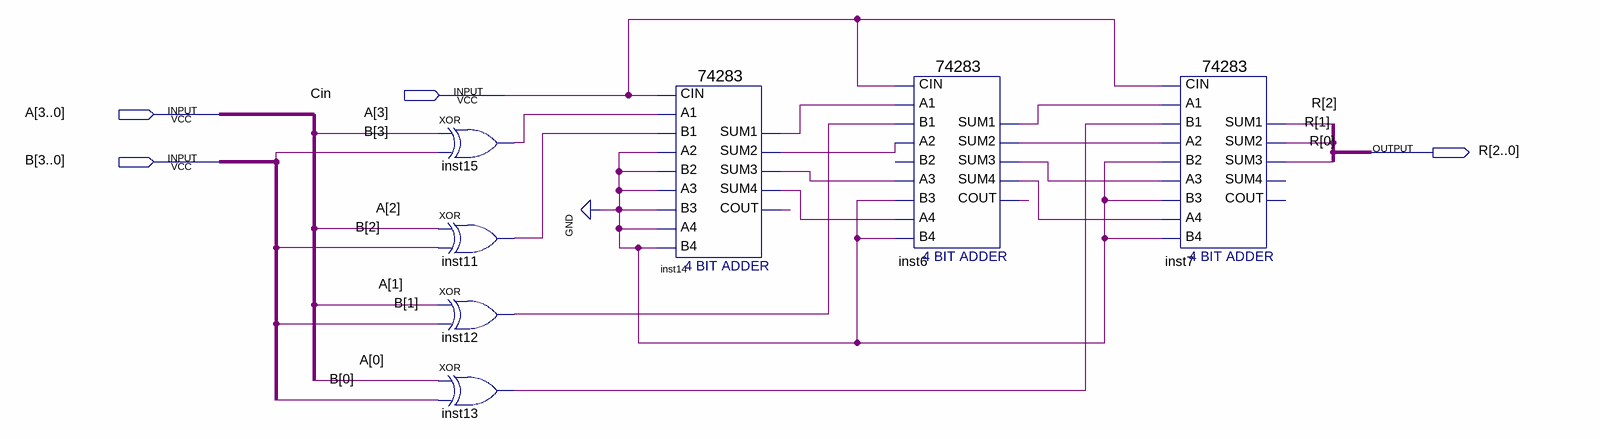
[diagram p0: schematic sheet]
// Quartus schematic Problema1.bdf as structural Verilog: 7 symbols, 4 pins
module Problema1 (
  input  Cin,
  input  [3:0] A,
  input  [3:0] B,
  output [2:0] R
);

  wire inst6_cout, inst6_sum1, inst6_sum2, inst6_sum3, inst6_sum4, inst11_out, inst12_out, inst13_out,
       inst14_cout, inst14_sum1, inst14_sum2, inst14_sum3, inst14_sum4, inst15_out;

  xor inst15 (inst15_out, A[3], B[3]);
  xor inst11 (inst11_out, A[2], B[2]);
  xor inst12 (inst12_out, A[1], B[1]);
  xor inst13 (inst13_out, A[0], B[0]);
  \74283  inst14 (
    .CIN(Cin), .A1(inst15_out), .A2(1'b0), .B2(1'b0), .A3(1'b0), .A4(1'b0), .B4(1'b0), .B1(inst11_out),
    .B3(1'b0), .SUM4(inst14_sum4), .COUT(inst14_cout), .SUM1(inst14_sum1), .SUM2(inst14_sum2),
    .SUM3(inst14_sum3));
  \74283  inst6 (
    .CIN(Cin), .A1(inst14_sum1), .A2(inst14_sum2), .A3(inst14_sum3), .A4(inst14_sum4), .B4(1'b0),
    .B1(inst12_out), .B3(1'b0), .SUM4(inst6_sum4), .COUT(inst6_cout), .SUM1(inst6_sum1), .SUM2(inst6_sum2),
    .SUM3(inst6_sum3));  // open: B2
  \74283  inst7 (
    .CIN(Cin), .A1(inst6_sum1), .A2(inst6_sum2), .B2(1'b0), .A3(inst6_sum3), .A4(inst6_sum4), .B4(1'b0),
    .B1(inst13_out), .B3(1'b0), .SUM1(R[2]), .SUM2(R[1]), .SUM3(R[0]));  // open: SUM4, COUT
endmodule
